# Altium schematic sheet ESP32_S3.SchDoc
size B; SheetNumber: 1; SheetTotal: 4
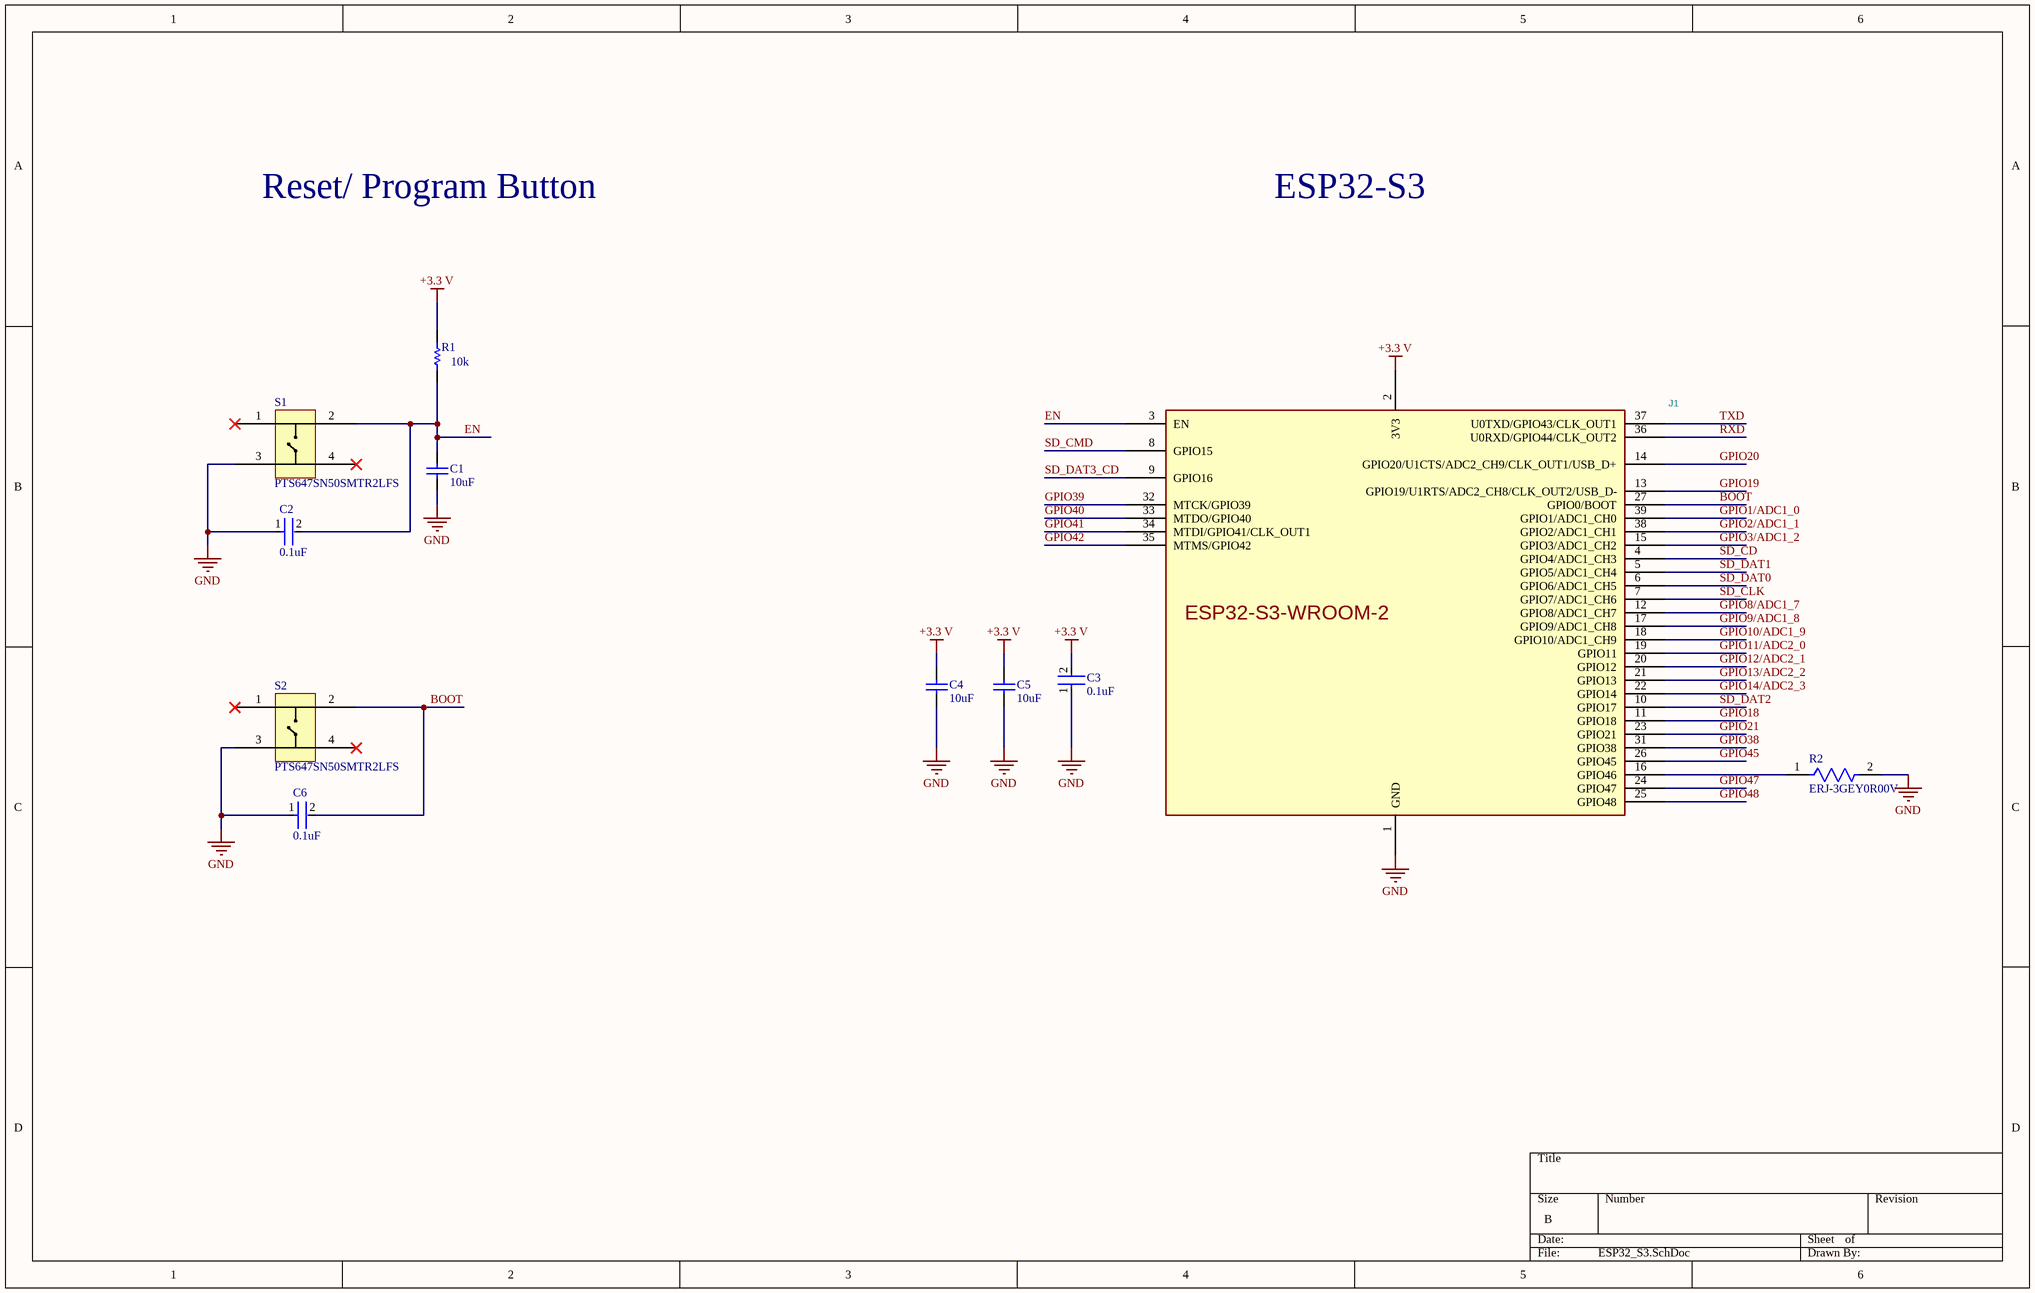
[diagram p0: ESP32_S3.SchDoc]

## Parts
C1  10uF  [CC0805ZKY5V6BB106-Footprint-1]
C2  0.1uF  [FP-CC0603-DA-IPC_A]
C3  0.1uF  [FP-CC0603-DA-IPC_A]
C4  10uF  [CC0805ZKY5V6BB106-Footprint-1]
C5  10uF  [CC0805ZKY5V6BB106-Footprint-1]
C6  0.1uF  [FP-CC0603-DA-IPC_A]
J1  ESP32-S3-WROOM-2  [ESP32-S3-WROOM-2]  (value not drawn)
R1  10k  [RESC2013X60X35ML10T20]
R2  ERJ-3GEY0R00V  [FP-ERJ-3GEY0R00V-IPC_A]
S1  PTS647SN50SMTR2LFS  [PTS647SN50SMTR2LFS-Footprint-1]
S2  PTS647SN50SMTR2LFS  [PTS647SN50SMTR2LFS-Footprint-1]

## Nets
+3.3 V: C3.2 C4.2 C5.2 J1.2(3V3) R1.2
GND: C1.1 C2.1 C3.1 C4.1 C5.1 C6.1 J1.1(GND) R2.2 S1.3 S2.3
BOOT: C6.2 J1.27(GPIO0/BOOT) S2.2
EN: C1.2 C2.2 J1.3(EN) R1.1 S1.2
GPIO1/ADC1_0: J1.39(GPIO1/ADC1_CH0)
GPIO2/ADC1_1: J1.38(GPIO2/ADC1_CH1)
GPIO3/ADC1_2: J1.15(GPIO3/ADC1_CH2)
GPIO8/ADC1_7: J1.12(GPIO8/ADC1_CH7)
GPIO9/ADC1_8: J1.17(GPIO9/ADC1_CH8)
GPIO10/ADC1_9: J1.18(GPIO10/ADC1_CH9)
GPIO11/ADC2_0: J1.19(GPIO11)
GPIO12/ADC2_1: J1.20(GPIO12)
GPIO13/ADC2_2: J1.21(GPIO13)
GPIO14/ADC2_3: J1.22(GPIO14)
GPIO18: J1.11(GPIO18)
GPIO19: J1.13(GPIO19/U1RTS/ADC2_CH8/CLK_OUT2/USB_D-)
GPIO20: J1.14(GPIO20/U1CTS/ADC2_CH9/CLK_OUT1/USB_D+)
GPIO21: J1.23(GPIO21)
GPIO38: J1.31(GPIO38)
GPIO39: J1.32(MTCK/GPIO39)
GPIO40: J1.33(MTDO/GPIO40)
GPIO41: J1.34(MTDI/GPIO41/CLK_OUT1)
GPIO42: J1.35(MTMS/GPIO42)
GPIO45: J1.26(GPIO45)
GPIO47: J1.24(GPIO47)
GPIO48: J1.25(GPIO48)
RXD: J1.36(U0RXD/GPIO44/CLK_OUT2)
SD_CD: J1.4(GPIO4/ADC1_CH3)
SD_CLK: J1.7(GPIO7/ADC1_CH6)
SD_CMD: J1.8(GPIO15)
SD_DAT0: J1.6(GPIO6/ADC1_CH5)
SD_DAT1: J1.5(GPIO5/ADC1_CH4)
SD_DAT2: J1.10(GPIO17)
SD_DAT3_CD: J1.9(GPIO16)
TXD: J1.37(U0TXD/GPIO43/CLK_OUT1)
NetJ1_16: J1.16(GPIO46) R2.1

Not connected (* = marked no-connect by the designer): J1 28(NC) 29(NC) 30(NC) 40(GND) 41(GND); S1 1* 4*; S2 1* 4*

## Notes on the sheet
- Reset/ Program Button
- ESP32-S3

## Library data of the parts
C1 C4 C5 = CMP-00010-2: Ceramic Capacitor, Multilayer, Ceramic, 10V, 80% +Tol, 20% -Tol, Y5V, -82/+22% TC, 10uF, Surface Mount, 0805; Multilayer: Yes; Min Operating Temperature: -30°C; Case/Package: 0805; Package Shape: Rectangular; RoHS Compliant: Yes; Termination: Wraparound; Package Style: SMTMeter; Packaging: Tape and Reel; Temperature Characteristics Code: Y5V; Pins: 2; Capacitor Type: Ceramic; Terminal Finish: Nickel; Tolerance (fill in as +-): 80%; Value: 10uF; Max Operating Temperature: 85°C; Length: 2mm; Width: 1.25mm; Dielectric Material: Ceramic; JESD-609 Code: e3; Reach SVHC Compliant: Yes; Height: 1.25mm; Tolerance  (fill in as +-): 20%; Mounting Technology: Surface Mount; Rated DC Voltage (URdc): 10V
C2 C3 C6 = CMP-00002-1: Ceramic Capacitor, Multilayer, Ceramic, 50V, 10% +Tol, 10% -Tol, X7R, 15% TC, 0.1uF, Surface Mount, 0603; Value: 100nF; Multilayer: Yes; Reach SVHC Compliant: Yes; Temperature Characteristics Code: X7R; Package Style: SMTMeter; Max Operating Temperature: 125°C; Dielectric Material: Ceramic; Mounting Technology: Surface Mount; Packaging: Tape and Reel; Width: 0.8mm; Min Operating Temperature: -55°C; Height: 0.8mm; RoHS Compliant: Yes; Rated DC Voltage (URdc): 50V; Tolerance (fill in as +-): 10%; Terminal Finish: Nickel; Case/Package: 0603; Length: 1.6mm; Tolerance  (fill in as +-): 10%; JESD-609 Code: e3; Package Shape: Rectangular; Capacitor Type: Ceramic; Pins: 2; Termination: Wraparound
J1 = CMP-024-000000-6: Reference: U; ki_description: 2.4 GHz WiFi (802.11 b/g/n) and Bluetooth ® 5 (LE) module Built around ESP32S3 series of SoCs, Xtensa ® dualcore 32bit LX7 microprocessor Flash up to 16 MB, PSRAM up to 8 MB 36 GPIOs, rich set of peripherals Onboard PCB antenna; Value: ESP32-S3-WROOM-2; Source: ESP32S3.SchLib; Datasheet: https://www.espressif.com/sites/default/files/documentation/esp32-s3-wroom-2_datasheet_en.pdf; Design Item ID: ESP32-S3-WROOM-2
R1 = CMP-00012-1: Fixed Resistor, Metal Glaze/thick Film, 0.125W, 10000ohm, 150V, 1% +/-Tol, 100ppm/Cel, Surface Mount, 0805; Package Width: 1.25mm; Rated Temperature: 70°C; Package Height: 0.5mm; Power: 125mW; Additional Feature: LASER TRIMMABLE; Temperature Coefficient: 100ppm/°C; Value: 10kR; Package Length: 2mm; Min Operating Temperature: -55°C; Working Voltage: 150V; Case/Package: 0805; Construction: Chip; Termination: Wraparound; Package Shape: Rectangular; Packaging: Tape and Reel; Technology: METAL GLAZE/THICK FILM; RoHS Compliant: Yes; Tolerance: 1%; Reach SVHC Compliant: Yes; Mounting Technology: Surface Mount; Pins: 2; Terminal Finish: Nickel; JESD-609 Code: e3; Max Operating Temperature: 155°C; Package Style: SMTMeter; Resistor Type: FIXED RESISTOR
R2 = CMP-00039-1: Fixed Resistor, Metal Glaze/thick Film, 0.1W, 0ohm, Surface Mount, 0603; Reference Standard: AEC-Q200; Power: 100mW; Rated Temperature: 70°C; Value: 0R; Package Height: 0.45mm; Package Width: 0.8mm; Package Length: 1.6mm; Package Style: SMTMeter; Mounting Technology: Surface Mount; Construction: Rectangular; Case/Package: 0603; Packaging: Tape and Reel; Resistor Type: FIXED RESISTOR; Reach SVHC Compliant: Yes; JESD-609 Code: e3; Package Shape: Rectangular; Technology: METAL GLAZE/THICK FILM; Min Operating Temperature: -55°C; Max Operating Temperature: 155°C; Pins: 2; Termination: Wraparound; Terminal Finish: Nickel; RoHS Compliant: Yes
S1 S2 = CMP-011-00013-3: Keypad Switch, 1 Switches, SPST, Momentary-tactile, 0.05A, 12VDC, 1.47N, Solder Terminal, Surface Mount-straight; RoHS Compliant: Yes